# Altium schematic sheet MainSheet.SchDoc
size A4; SheetNumber: 1; SheetTotal: 18
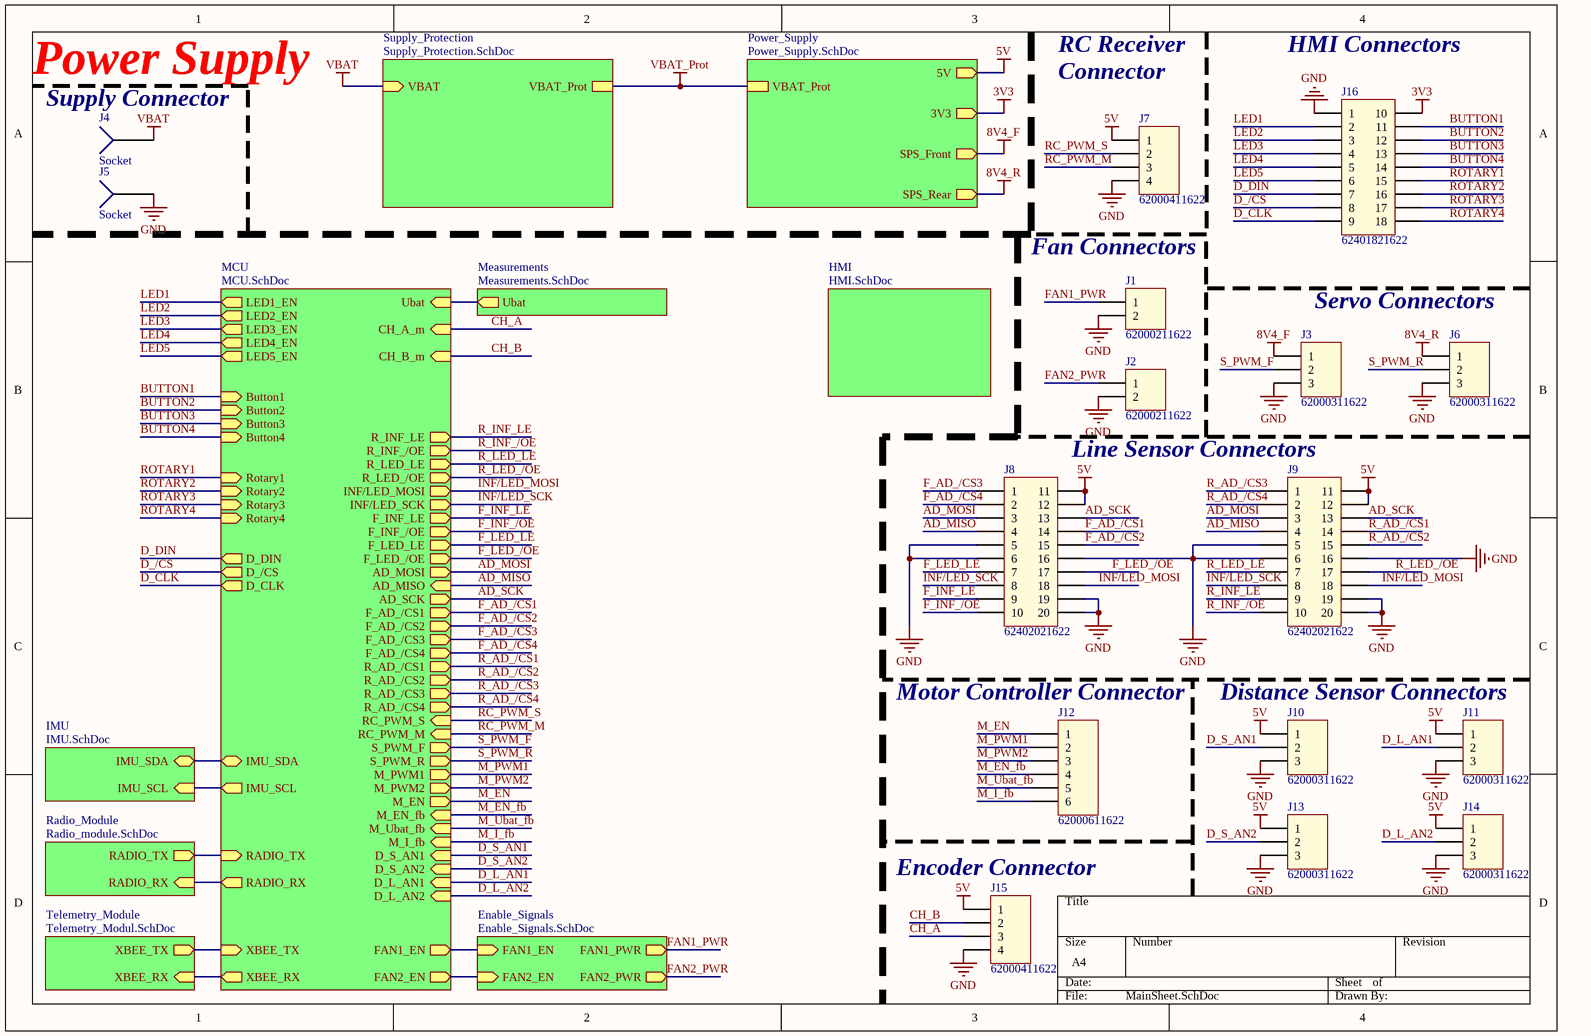
[diagram p0: MainSheet.SchDoc]

## Parts
J1  62000211622  [62000211622]
J2  62000211622  [62000211622]
J3  62000311622  [62000311622]
J4  Socket  [TAB 6.35MM x 0.81MM]
J5  Socket  [TAB 6.35MM x 0.81MM]
J6  62000311622  [62000311622]
J7  62000411622  [62000411622]
J8  62402021622  [62402021622]
J9  62402021622  [62402021622]
J10  62000311622  [62000311622]
J11  62000311622  [62000311622]
J12  62000611622  [62000611622]
J13  62000311622  [62000311622]
J14  62000311622  [62000311622]
J15  62000411622  [62000411622]
J16  62401821622  [62401821622]

## Sub-sheets
Enable_Signals = Enable_Signals.SchDoc: FAN1_PWR (out), FAN2_PWR (out), FAN1_EN (in), FAN2_EN (in)
HMI = HMI.SchDoc: no entries
IMU = IMU.SchDoc: IMU_SDA (bidir), IMU_SCL (in)
MCU = MCU.SchDoc: Ubat (in), IMU_SDA (bidir), IMU_SCL (out), RADIO_TX (in), RADIO_RX (out), XBEE_TX (in), XBEE_RX (out), FAN2_EN (out), FAN1_EN (out), D_L_AN2 (in), D_L_AN1 (in), D_S_AN2 (in), D_S_AN1 (in), M_I_fb (in), M_Ubat_fb (in), M_EN_fb (in), M_EN (out), M_PWM2 (out), M_PWM1 (out), S_PWM_R (out), S_PWM_F (out), RC_PWM_M (in), RC_PWM_S (in), R_AD_/CS4 (out), R_AD_/CS3 (out), R_AD_/CS2 (out), R_AD_/CS1 (out), F_AD_/CS4 (out), CH_B_m (in), CH_A_m (in), F_AD_/CS3 (out), F_AD_/CS2 (out), F_AD_/CS1 (out), AD_SCK (out), AD_MISO (in), AD_MOSI (out), F_LED_/OE (out), F_LED_LE (out), F_INF_/OE (out), F_INF_LE (out), INF/LED_SCK (out), INF/LED_MOSI (out), R_LED_/OE (out), R_LED_LE (out), R_INF_/OE (out), R_INF_LE (out), LED1_EN (out), LED2_EN (out), LED3_EN (out), LED4_EN (out), LED5_EN (out), Button1 (in), Button3 (in), Button4 (in), Button2 (in), D_DIN (out), D_/CS (out), D_CLK (out), Rotary1 (in), Rotary2 (in), Rotary3 (in), Rotary4 (in)
Measurements = Measurements.SchDoc: Ubat (out)
Power_Supply = Power_Supply.SchDoc: VBAT_Prot, 5V (out), 3V3 (out), SPS_Rear (out), SPS_Front (out)
Radio_Module = Radio_module.SchDoc: RADIO_TX (out), RADIO_RX (in)
Supply_Protection = Supply_Protection.SchDoc: VBAT (in), VBAT_Prot
Telemetry_Module = Telemetry_Modul.SchDoc: XBEE_TX (out), XBEE_RX (in)

## Nets
3V3: J16.10 ; sheet Power_Supply/3V3
5V: J7.1 J8.11 J8.12 J9.11 J9.12 J10.1 J11.1 J13.1 J14.1 J15.1 ; sheet Power_Supply/5V
8V4_F: J3.1 ; sheet Power_Supply/SPS_Front
8V4_R: J6.1 ; sheet Power_Supply/SPS_Rear
GND: J1.2 J2.2 J3.3 J5.1 J6.3 J7.4 J8.5 J8.6 J8.16 J8.19 J8.20 J9.5 J9.6 J9.16 J9.19 J9.20 J10.3 J11.3 J13.3 J14.3 J15.4 J16.1
VBAT: J4.1 ; sheet Supply_Protection/VBAT
VBAT_Prot: sheet Supply_Protection/VBAT_Prot, sheet Power_Supply/VBAT_Prot
AD_MISO: J8.4 J9.4 ; sheet MCU/AD_MISO
AD_MOSI: J8.3 J9.3 ; sheet MCU/AD_MOSI
AD_SCK: J8.13 J9.13 ; sheet MCU/AD_SCK
BUTTON1: J16.11 ; sheet MCU/Button1
BUTTON2: J16.12 ; sheet MCU/Button2
BUTTON3: J16.13 ; sheet MCU/Button3
BUTTON4: J16.14 ; sheet MCU/Button4
CH_A: J15.3 ; sheet MCU/CH_A_m
CH_B: J15.2 ; sheet MCU/CH_B_m
D_/CS: J16.8 ; sheet MCU/D_/CS
D_CLK: J16.9 ; sheet MCU/D_CLK
D_DIN: J16.7 ; sheet MCU/D_DIN
D_L_AN1: J11.2 ; sheet MCU/D_L_AN1
D_L_AN2: J14.2 ; sheet MCU/D_L_AN2
D_S_AN1: J10.2 ; sheet MCU/D_S_AN1
D_S_AN2: J13.2 ; sheet MCU/D_S_AN2
F_AD_/CS1: J8.14 ; sheet MCU/F_AD_/CS1
F_AD_/CS2: J8.15 ; sheet MCU/F_AD_/CS2
F_AD_/CS3: J8.1 ; sheet MCU/F_AD_/CS3
F_AD_/CS4: J8.2 ; sheet MCU/F_AD_/CS4
F_INF_/OE: J8.10 ; sheet MCU/F_INF_/OE
F_INF_LE: J8.9 ; sheet MCU/F_INF_LE
F_LED_/OE: J8.17 ; sheet MCU/F_LED_/OE
F_LED_LE: J8.7 ; sheet MCU/F_LED_LE
FAN1_PWR: J1.1 ; sheet Enable_Signals/FAN1_PWR
FAN2_PWR: J2.1 ; sheet Enable_Signals/FAN2_PWR
INF/LED_MOSI: J8.18 J9.18 ; sheet MCU/INF/LED_MOSI
INF/LED_SCK: J8.8 J9.8 ; sheet MCU/INF/LED_SCK
LED1: J16.2 ; sheet MCU/LED1_EN
LED2: J16.3 ; sheet MCU/LED2_EN
LED3: J16.4 ; sheet MCU/LED3_EN
LED4: J16.5 ; sheet MCU/LED4_EN
LED5: J16.6 ; sheet MCU/LED5_EN
M_EN: J12.1 ; sheet MCU/M_EN
M_EN_fb: J12.4 ; sheet MCU/M_EN_fb
M_I_fb: J12.6 ; sheet MCU/M_I_fb
M_PWM1: J12.2 ; sheet MCU/M_PWM1
M_PWM2: J12.3 ; sheet MCU/M_PWM2
M_Ubat_fb: J12.5 ; sheet MCU/M_Ubat_fb
R_AD_/CS1: J9.14 ; sheet MCU/R_AD_/CS1
R_AD_/CS2: J9.15 ; sheet MCU/R_AD_/CS2
R_AD_/CS3: J9.1 ; sheet MCU/R_AD_/CS3
R_AD_/CS4: J9.2 ; sheet MCU/R_AD_/CS4
R_INF_/OE: J9.10 ; sheet MCU/R_INF_/OE
R_INF_LE: J9.9 ; sheet MCU/R_INF_LE
R_LED_/OE: J9.17 ; sheet MCU/R_LED_/OE
R_LED_LE: J9.7 ; sheet MCU/R_LED_LE
RC_PWM_M: J7.3 ; sheet MCU/RC_PWM_M
RC_PWM_S: J7.2 ; sheet MCU/RC_PWM_S
ROTARY1: J16.15 ; sheet MCU/Rotary1
ROTARY2: J16.16 ; sheet MCU/Rotary2
ROTARY3: J16.17 ; sheet MCU/Rotary3
ROTARY4: J16.18 ; sheet MCU/Rotary4
S_PWM_F: J3.2 ; sheet MCU/S_PWM_F
S_PWM_R: J6.2 ; sheet MCU/S_PWM_R
(unnamed): sheet MCU/Ubat, sheet Measurements/Ubat
(unnamed): sheet MCU/IMU_SDA, sheet IMU/IMU_SDA
(unnamed): sheet MCU/IMU_SCL, sheet IMU/IMU_SCL
(unnamed): sheet MCU/RADIO_TX, sheet Radio_Module/RADIO_TX
(unnamed): sheet MCU/RADIO_RX, sheet Radio_Module/RADIO_RX
(unnamed): sheet MCU/XBEE_TX, sheet Telemetry_Module/XBEE_TX
(unnamed): sheet MCU/XBEE_RX, sheet Telemetry_Module/XBEE_RX
(unnamed): sheet MCU/FAN2_EN, sheet Enable_Signals/FAN2_EN
(unnamed): sheet MCU/FAN1_EN, sheet Enable_Signals/FAN1_EN

## Notes on the sheet
- Power Supply
- (near J4) Supply Connector
- RC Receiver
- Connector
- HMI Connectors
- Fan Connectors
- Servo Connectors
- Line Sensor Connectors
- (near J12) Motor Controller Connector
- Distance Sensor Connectors
- (near J15) Encoder Connector

## Library data of the parts
J1 J2 = 62000211622: WR-WTB 2.00mm Male Vertical Shrouded Header, 2p; Pin Number: 2; ID: WE 1x2 Vertical THT; Note: Positive Lock; ComponentLink1Description: Manufacturer; ComponentLink1URL: http://www.we-online.de; ComponentLink2Description: Datasheet; ComponentLink2URL: http://katalog.we-online.de/em/datasheet/6200xx11622.pdf; Part Number: 62000211622; Published Date: June 2017; Publisher: Wurth Elektronik; Pitch: 2.00 mm; Order Number: 62000211622; Package: 62000211622; NI part number: -; NI PEN/DEB: -; Type: Header WE 2-way; Distributor: Würth; Link: http://katalog.we-online.de/em/datasheet/6200xx11622.pdf; Price (HUF): 0
J3 J6 J10 J11 J13 J14 = 62000311622: WR-WTB 2.00mm Male Vertical Shrouded Header, 3p; Pin Number: 3; ID: WE 1x3 Vertical THT; Note: Positive Lock; ComponentLink1Description: Manufacturer; ComponentLink1URL: http://www.we-online.de; ComponentLink2Description: Datasheet; ComponentLink2URL: http://katalog.we-online.de/em/datasheet/6200xx11622.pdf; Part Number: 62000311622; Published Date: June 2017; Publisher: Wurth Elektronik; Pitch: 2.00 mm; Order Number: 62000311622; Package: 62000311622; NI part number: -; NI PEN/DEB: -; Type: Header WE 3-way; Distributor: Würth; Link: http://katalog.we-online.de/em/datasheet/6200xx11622.pdf; Price (HUF): 0
J4 J5 = 1217861-1 TERMINAL: ID: Con_1217861-1 TERMINAL; Order number: 1924184; Distributor: Farnell; Link: http://hu.farnell.com/te-connectivity-amp/1217861-1/terminal-tab-6-35mm-x-0-81mm-solder/dp/1924184?ost=1924184&selectedCategoryId=&categoryName=%C3%96sszes+kateg%C3%B3ria&categoryNameResp=%C3%96sszes+kateg%C3%B3ria; Package: TAB 6.35MM x 0.81MM; Part Number: 1217861-1 TERMINAL; Price (HUF): 22; Type: TAB; NI part number: -; NI PEN/DEB: -
J7 J15 = 62000411622: WR-WTB 2.00mm Male Vertical Shrouded Header, 4p; Pin Number: 4; ID: WE 1x4 Vertical THT; Note: Positive Lock; ComponentLink1Description: Manufacturer; ComponentLink1URL: http://www.we-online.de; ComponentLink2Description: Datasheet; ComponentLink2URL: http://katalog.we-online.de/em/datasheet/6200xx11622.pdf; Part Number: 62000411622; Published Date: June 2017; Publisher: Wurth Elektronik; Pitch: 2.00 mm; Order Number: 62000411622; Package: 62000411622; NI part number: -; NI PEN/DEB: -; Type: Header WE 4-way; Distributor: Würth; Link: http://katalog.we-online.de/em/datasheet/6200xx11622.pdf; Price (HUF): 0
J8 J9 = 62402021622: WR-WTB 2.00mm Male Dual Row Vertical Shrouded Header with positive locking, 20p; Pin Number: 20; ID: WE 2x10 Vertical THT; ComponentLink1Description: Manufacturer; ComponentLink1URL: http://www.we-online.de; ComponentLink2Description: Datasheet; ComponentLink2URL: http://katalog.we-online.de/em/datasheet/6240xx21622.pdf; Part Number: 62402021622; Published Date: June 2017; Publisher: Wurth Elektronik; Pitch: 2.00 mm; Order Number: 62402021622; Package: 62402021622; NI part number: -; NI PEN/DEB: -; Type: Header WE 20-way; Distributor: Würth; Link: http://katalog.we-online.de/em/datasheet/6240xx21622.pdf; Price (HUF): 0; Note: Positive Lock
J12 = 62000611622: WR-WTB 2.00mm Male Vertical Shrouded Header, 6p; Pin Number: 6; ID: WE 1x6 Vertical THT; Note: Positive Lock; ComponentLink1Description: Manufacturer; ComponentLink1URL: http://www.we-online.de; ComponentLink2Description: Datasheet; ComponentLink2URL: http://katalog.we-online.de/em/datasheet/6200xx11622.pdf; Part Number: 62000611622; Published Date: June 2017; Publisher: Wurth Elektronik; Pitch: 2.00 mm; Order Number: 62000611622; Package: 62000611622; NI part number: -; NI PEN/DEB: -; Type: Header WE 6-way; Distributor: Würth; Link: http://katalog.we-online.de/em/datasheet/6200xx11622.pdf; Price (HUF): 0
J16 = 62401821622: WR-WTB 2.00mm Male Dual Row Vertical Shrouded Header with positive locking, 18p; Pin Number: 18; ID: WE 2x9 Vertical THT; ComponentLink1Description: Manufacturer; ComponentLink1URL: http://www.we-online.de; ComponentLink2Description: Datasheet; ComponentLink2URL: http://katalog.we-online.de/em/datasheet/6240xx21622.pdf; Part Number: 62401821622; Published Date: June 2017; Publisher: Wurth Elektronik; Pitch: 2.00 mm; Order Number: 62401821622; Package: 62401821622; NI part number: -; NI PEN/DEB: -; Type: Header WE 18-way; Distributor: Würth; Link: http://katalog.we-online.de/em/datasheet/6240xx21622.pdf; Price (HUF): 0; Note: Positive Lock